# EAGLE design main (EAGLE 9.6.2)
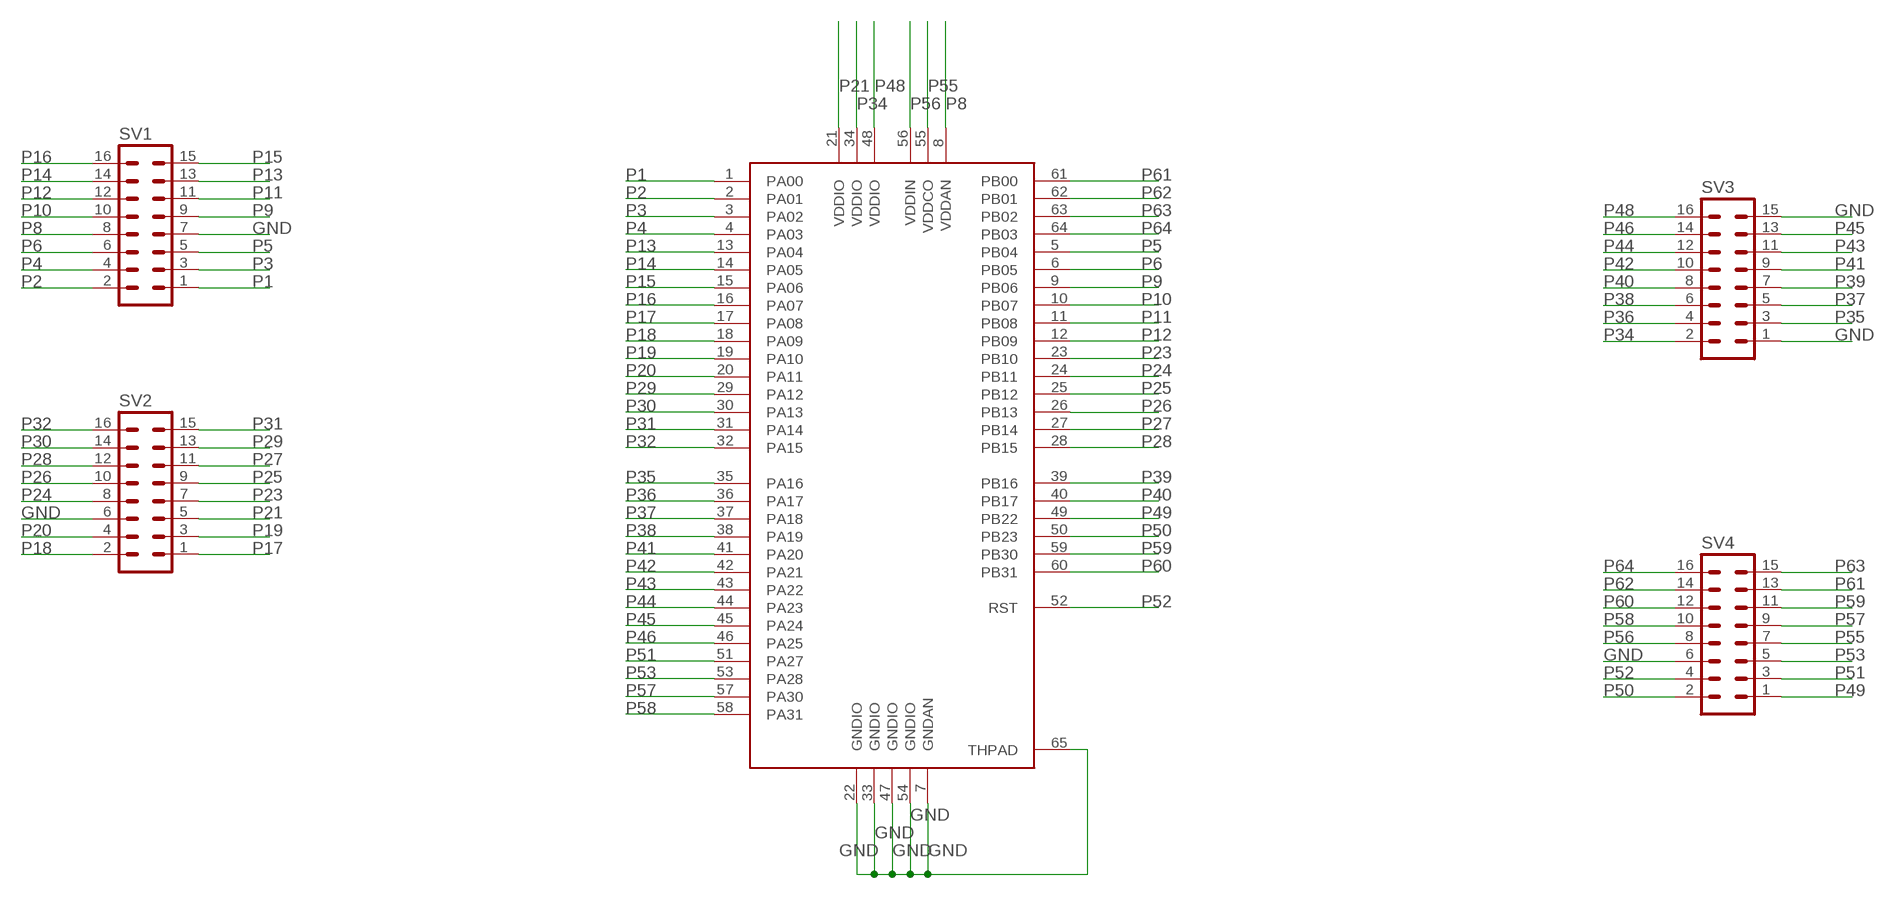
[diagram p0: schematic, sheet 1]

## Parts
SV1  MA08-2  [MA08-2]
SV2  MA08-2  [MA08-2]
SV3  MA08-2  [MA08-2]
SV4  MA08-2  [MA08-2]
U$1  ATSAMD21J18AQFN64  [QFN50P900X900X100-65T535]

## Nets
GND: SV1.7 SV2.6 SV3.1 SV3.15 SV4.6 U$1.7(GNDAN) U$1.22(GNDIO) U$1.33(GNDIO) U$1.47(GNDIO) U$1.54(GNDIO) U$1.65(THPAD)
P1: SV1.1 U$1.1(PA00)
P2: SV1.2 U$1.2(PA01)
P3: SV1.3 U$1.3(PA02)
P4: SV1.4 U$1.4(PA03)
P5: SV1.5 U$1.5(PB04)
P6: SV1.6 U$1.6(PB05)
P8: SV1.8 U$1.8(VDDAN)
P9: SV1.9 U$1.9(PB06)
P10: SV1.10 U$1.10(PB07)
P11: SV1.11 U$1.11(PB08)
P12: SV1.12 U$1.12(PB09)
P13: SV1.13 U$1.13(PA04)
P14: SV1.14 U$1.14(PA05)
P15: SV1.15 U$1.15(PA06)
P16: SV1.16 U$1.16(PA07)
P17: SV2.1 U$1.17(PA08)
P18: SV2.2 U$1.18(PA09)
P19: SV2.3 U$1.19(PA10)
P20: SV2.4 U$1.20(PA11)
P21: SV2.5 U$1.21(VDDIO)
P23: SV2.7 U$1.23(PB10)
P24: SV2.8 U$1.24(PB11)
P25: SV2.9 U$1.25(PB12)
P26: SV2.10 U$1.26(PB13)
P27: SV2.11 U$1.27(PB14)
P28: SV2.12 U$1.28(PB15)
P29: SV2.13 U$1.29(PA12)
P30: SV2.14 U$1.30(PA13)
P31: SV2.15 U$1.31(PA14)
P32: SV2.16 U$1.32(PA15)
P34: SV3.2 U$1.34(VDDIO)
P35: SV3.3 U$1.35(PA16)
P36: SV3.4 U$1.36(PA17)
P37: SV3.5 U$1.37(PA18)
P38: SV3.6 U$1.38(PA19)
P39: SV3.7 U$1.39(PB16)
P40: SV3.8 U$1.40(PB17)
P41: SV3.9 U$1.41(PA20)
P42: SV3.10 U$1.42(PA21)
P43: SV3.11 U$1.43(PA22)
P44: SV3.12 U$1.44(PA23)
P45: SV3.13 U$1.45(PA24)
P46: SV3.14 U$1.46(PA25)
P48: SV3.16 U$1.48(VDDIO)
P49: SV4.1 U$1.49(PB22)
P50: SV4.2 U$1.50(PB23)
P51: SV4.3 U$1.51(PA27)
P52: SV4.4 U$1.52(RST)
P53: SV4.5 U$1.53(PA28)
P55: SV4.7 U$1.55(VDDCO)
P56: SV4.8 U$1.56(VDDIN)
P57: SV4.9 U$1.57(PA30)
P58: SV4.10 U$1.58(PA31)
P59: SV4.11 U$1.59(PB30)
P60: SV4.12 U$1.60(PB31)
P61: SV4.13 U$1.61(PB00)
P62: SV4.14 U$1.62(PB01)
P63: SV4.15 U$1.63(PB02)
P64: SV4.16 U$1.64(PB03)

## Library data of the parts
SV1-SV4 = con-lstb_custom2:MA08-2: PIN HEADER; OC_FARNELL: unknown; OC_NEWARK: unknown
U$1 = atsamd21j18a:ATSAMD21J18A

## Board
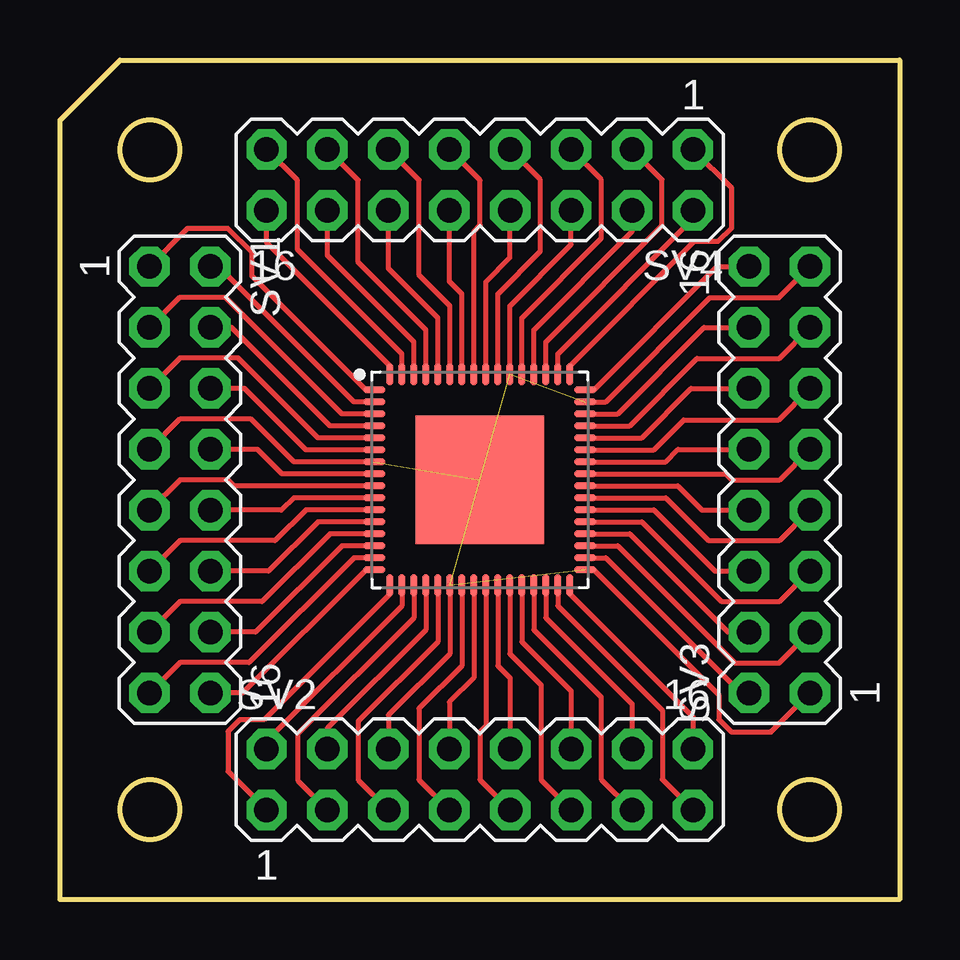
[diagram p1: board, top side]

Size 35 x 35 mm. Coordinates in mm from the lower left corner, seen from the top.
Outline: 0,32.5 2.5,35 35,35 35,0 0,0 0,32.5
Outline: circle at 31.25,31.25 radius 1.25
Outline: circle at 3.75,31.25 radius 1.25
Outline: circle at 3.75,3.75 radius 1.25
Outline: circle at 31.25,3.75 radius 1.25
Copper layers (1*16): Top 0.035mm / dielectric 1.5mm / Bottom 0.035mm
Design rules "default *": minimum track width 6mil, minimum drill 0.35mm, track to track 0.25mm, track to pad 8mil, pad to pad 8mil, via to via 8mil, smd to smd 8mil, copper to edge 40mil, drill to drill 6mil, minimum pad ring 10mil, minimum via ring 8mil, stop-mask expansion 4mil, vias tented up to drill 0mil, thermal gap 10mil

### Footprints (pad centres in the part's own frame; a part is rotated, then mirrored left to right if it is on the bottom)
MA08-2 = drill 1.016 pad 1.676 octagon: 1 -8.89,-1.27; 2 -8.89,1.27; 3 -6.35,-1.27; 4 -6.35,1.27; 5 -3.81,-1.27; 6 -3.81,1.27; 7 -1.27,-1.27; 8 -1.27,1.27; 9 1.27,-1.27; 10 1.27,1.27; 11 3.81,-1.27; 12 3.81,1.27; 13 6.35,-1.27; 14 6.35,1.27; 15 8.89,-1.27; 16 8.89,1.27
QFN50P900X900X100-65T535 = smd 0.911 x 0.264: 1 -4.401,3.75; 2 -4.401,3.25; 3 -4.401,2.75; 4 -4.401,2.25; 5 -4.401,1.75; 6 -4.401,1.25; 7 -4.401,0.75; 8 -4.401,0.25; 9 -4.401,-0.25; 10 -4.401,-0.75; 11 -4.401,-1.25; 12 -4.401,-1.75; 13 -4.401,-2.25; 14 -4.401,-2.75; 15 -4.401,-3.25; 16 -4.401,-3.75; 33 4.401,-3.75; 34 4.401,-3.25; 35 4.401,-2.75; 36 4.401,-2.25; 37 4.401,-1.75; 38 4.401,-1.25; 39 4.401,-0.75; 40 4.401,-0.25; 41 4.401,0.25; 42 4.401,0.75; 43 4.401,1.25; 44 4.401,1.75; 45 4.401,2.25; 46 4.401,2.75; 47 4.401,3.25; 48 4.401,3.75 | smd 0.264 x 0.911: 17 -3.75,-4.401; 18 -3.25,-4.401; 19 -2.75,-4.401; 20 -2.25,-4.401; 21 -1.75,-4.401; 22 -1.25,-4.401; 23 -0.75,-4.401; 24 -0.25,-4.401; 25 0.25,-4.401; 26 0.75,-4.401; 27 1.25,-4.401; 28 1.75,-4.401; 29 2.25,-4.401; 30 2.75,-4.401; 31 3.25,-4.401; 32 3.75,-4.401; 49 3.75,4.401; 50 3.25,4.401; 51 2.75,4.401; 52 2.25,4.401; 53 1.75,4.401; 54 1.25,4.401; 55 0.75,4.401; 56 0.25,4.401; 57 -0.25,4.401; 58 -0.75,4.401; 59 -1.25,4.401; 60 -1.75,4.401; 61 -2.25,4.401; 62 -2.75,4.401; 63 -3.25,4.401; 64 -3.75,4.401 | smd 5.35 x 5.35: 65 0,0

### Placement (x,y rotation side)
SV1  5,17.5 270 top
SV2  17.5,5 0 top
SV3  30,17.5 90 top
SV4  17.5,30 180 top
U$1  17.5,17.5 0 top

### Tracks (layer width: path | path; a pad name or v marks a point on that pad's centre or on a via)
GND  (5 unrouted)
  Top 0.203: U$1.54 18.75,24.75 21.31,27.31 SV4.6 | U$1.47 22.75,20.75 27.09,25.09 29.97,25.09 SV3.15 | U$1.33 22.25,13.75 27.46,8.54 27.46,7.51 27.99,6.98 29.64,6.98 SV3.1 | U$1.22 16.25,10.25 13.69,7.69 SV2.6 | U$1.7 9.75,18.25 7.97,20.03 4.99,20.03 SV1.7
P1
  Top 0.203: U$1.1 12.75,21.25 8,26 8,26.96 6.99,27.97 5.31,27.97 SV1.1
P2
  Top 0.203: U$1.2 12.25,20.75 6.61,26.39 SV1.2
P3
  Top 0.203: U$1.3 11.75,20.25 6.91,25.09 4.97,25.09 SV1.3
P4
  Top 0.203: U$1.4 11.25,19.75 7.15,23.85 SV1.4
P5
  Top 0.203: U$1.5 10.75,19.25 7.42,22.58 5,22.58 SV1.5
P6
  Top 0.203: U$1.6 10.25,18.75 7.69,21.31 SV1.6
P8
  Top 0.203: U$1.8 9.25,17.75 8.23,18.77 SV1.8
P9
  Top 0.203: U$1.9 7.25,17.25 7,17.5 5,17.5 SV1.9
P10
  Top 0.203: U$1.10 9.75,16.75 9.23,16.23 SV1.10
P11
  Top 0.203: U$1.11 10.25,16.25 8.96,14.96 5,14.96 SV1.11
P12
  Top 0.203: U$1.12 10.75,15.75 8.69,13.69 SV1.12
P13
  Top 0.203: U$1.13 11.25,15.25 8.42,12.42 5,12.42 SV1.13
P14
  Top 0.203: U$1.14 11.75,14.75 8.15,11.15 SV1.14
P15
  Top 0.203: U$1.15 12.25,14.25 7.88,9.88 5,9.88 SV1.15
P16
  Top 0.203: U$1.16 12.75,13.75 7.61,8.61 SV1.16
P17
  Top 0.203: U$1.17 13.75,12.75 8.5,7.5 7.49,7.5 7,7.01 7,5.34 SV2.1
P18
  Top 0.203: U$1.18 14.25,12.25 8.61,6.61 SV2.2
P19
  Top 0.203: U$1.19 14.75,11.75 9.91,6.91 9.91,4.97 SV2.3
P20
  Top 0.203: U$1.20 15.25,11.25 11.15,7.15 SV2.4
P21
  Top 0.203: U$1.21 15.75,10.75 12.43,7.43 12.43,4.99 SV2.5
P23
  Top 0.203: U$1.23 16.75,9.75 14.96,7.96 14.96,5 SV2.7
P24
  Top 0.203: U$1.24 17.25,9.25 16.23,8.23 SV2.8
P25
  Top 0.203: U$1.25 17.75,7.25 17.5,7 17.5,5 SV2.9
P26
  Top 0.203: U$1.26 18.25,9.75 18.77,9.23 SV2.10
P27
  Top 0.203: U$1.27 18.75,10.25 20.06,8.94 20.06,4.98 SV2.11
P28
  Top 0.203: U$1.28 19.25,10.75 21.31,8.69 SV2.12
P29
  Top 0.203: U$1.29 19.75,11.25 22.56,8.44 22.56,5.02 SV2.13
P30
  Top 0.203: U$1.30 20.25,11.75 23.85,8.15 SV2.14
P31
  Top 0.203: U$1.31 20.75,12.25 25.11,7.89 25.11,5.01 SV2.15
P32
  Top 0.203: U$1.32 21.25,12.75 26.39,7.61 SV2.16
P34
  Top 0.203: U$1.34 22.75,14.25 28.39,8.61 SV3.2
P35
  Top 0.203: U$1.35 23.25,14.75 28.14,9.86 29.98,9.86 SV3.3
P36
  Top 0.203: U$1.36 23.75,15.25 27.85,11.15 SV3.4
P37
  Top 0.203: U$1.37 24.25,15.75 27.57,12.43 30.01,12.43 SV3.5
P38
  Top 0.203: U$1.38 24.75,16.25 27.31,13.69 SV3.6
P39
  Top 0.203: U$1.39 25.25,16.75 27.03,14.97 30.01,14.97 SV3.7
P40
  Top 0.203: U$1.40 25.75,17.25 26.77,16.23 SV3.8
P41
  Top 0.203: U$1.41 27.75,17.75 28,17.5 30,17.5 SV3.9
P42
  Top 0.203: U$1.42 25.25,18.25 25.77,18.77 SV3.10
P43
  Top 0.203: U$1.43 24.75,18.75 26,20 29.96,20 SV3.11
P44
  Top 0.203: U$1.44 24.25,19.25 26.31,21.31 SV3.12
P45
  Top 0.203: U$1.45 23.75,19.75 26.56,22.56 29.98,22.56 SV3.13
P46
  Top 0.203: U$1.46 23.25,20.25 26.85,23.85 SV3.14
P48
  Top 0.203: U$1.48 22.25,21.25 27.39,26.39 SV3.16
P49
  Top 0.203: U$1.49 21.25,22.25 26.44,27.44 27.43,27.44 28,28.01 28,29.66 SV4.1
P50
  Top 0.203: U$1.50 20.75,22.75 26.39,28.39 SV4.2
P51
  Top 0.203: U$1.51 20.25,23.25 25.1,28.1 25.1,30.02 SV4.3
P52
  Top 0.203: U$1.52 19.75,23.75 23.85,27.85 SV4.4
P53
  Top 0.203: U$1.53 19.25,24.25 22.57,27.57 22.57,30.01 SV4.5
P55
  Top 0.203: U$1.55 18.25,25.25 20.03,27.03 20.03,30.01 SV4.7
P56
  Top 0.203: U$1.56 17.75,25.75 18.76,26.76 SV4.8
P57
  Top 0.203: U$1.57 17.25,27.84 17.52,28.11 17.52,29.98 SV4.9
P58
  Top 0.203: U$1.58 16.75,25.25 16.23,25.77 SV4.10
P59
  Top 0.203: U$1.59 16.25,24.75 14.97,26.03 14.97,29.99 SV4.11
P60
  Top 0.203: U$1.60 15.75,24.25 13.69,26.31 SV4.12
P61
  Top 0.203: U$1.61 15.25,23.75 12.43,26.57 12.43,29.99 SV4.13
P62
  Top 0.203: U$1.62 14.75,23.25 11.15,26.85 SV4.14
P63
  Top 0.203: U$1.63 14.25,22.75 9.9,27.1 9.9,29.98 SV4.15
P64
  Top 0.203: U$1.64 13.75,22.25 8.61,27.39 SV4.16